# EAGLE design sddrive (EAGLE 9.6.2)
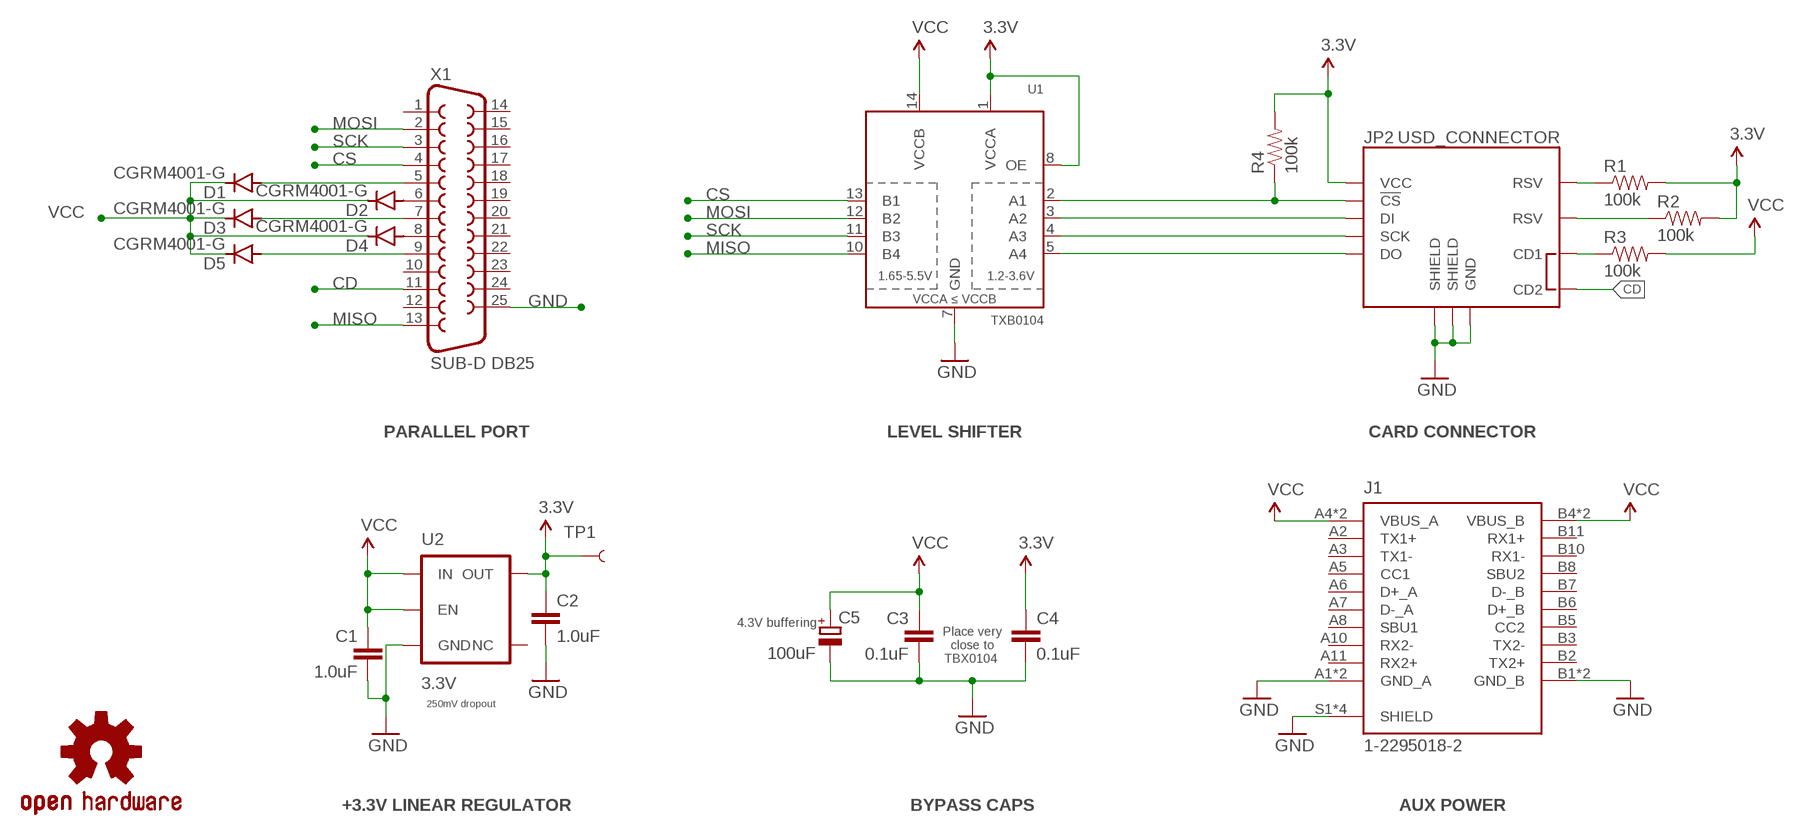
[diagram p0: schematic, sheet 1]

## Parts
C1  1.0uF  1.0UF-16V-10%(0603)  [0603-CAP]
C2  1.0uF  1.0UF-16V-10%(0603)  [0603-CAP]
C3  0.1uF  0.1UF-25V(+80/-20%)(0603)  [0603-CAP]
C4  0.1uF  0.1UF-25V(+80/-20%)(0603)  [0603-CAP]
C5  100uF  CPOL-EUC  [PANASONIC_C]
D1  CGRM4001-G  [SOD-123_MINI-SMA]
D2  CGRM4001-G  [SOD-123_MINI-SMA]
D3  CGRM4001-G  [SOD-123_MINI-SMA]
D4  CGRM4001-G  [SOD-123_MINI-SMA]
D5  CGRM4001-G  [SOD-123_MINI-SMA]
J1  1-2295018-2  [TE_1-2295018-2]
JP2  USD_CONNECTOR  [MICRO-SD-SOCKET-PP]
LOGO2  OSHW-LOGOS  [OSHW-LOGO-S]
R1  100k  100KOHM-1/10W-1%(0603)  [0603-RES]
R2  100k  100KOHM-1/10W-1%(0603)  [0603-RES]
R3  100k  100KOHM-1/10W-1%(0603)  [0603-RES]
R4  100k  100KOHM-1/10W-1%(0603)  [0603-RES]
TP1  TEST-POINT3  [PAD.03X.03]
U1  TXB0104  TXB0104PWRSOIC14  [SO14]
U2  3.3V  V_REG_AP2112K-3.3V  [SOT23-5]
X1  SUB-D DB25  F25D  [F25D]

## Nets
3V3: C2.1 C4.1 JP2.VCC R1.2 R2.2 R4.2 TP1.P$1 U1.1(VCCA) U1.8(OE) U2.5(OUT) ; supply symbol labelled 3.3V
!CS_3V3: JP2.CS(!CS) R4.1 U1.2(A1)
CD: JP2.CD2 X1.11
CDSDSD: JP2.CD1 R3.1
CS: U1.13(B1) X1.4
DI_3V3: JP2.DI U1.3(A2)
DO_3V3: JP2.DO U1.5(A4)
GND: C1.2 C2.2 C3.2 C4.2 C5.- J1.A1(GND_A) J1.A12(GND_A) J1.B1(GND_B) J1.B12(GND_B) J1.S1(SHIELD) J1.S2(SHIELD) J1.S3(SHIELD) J1.S4(SHIELD) JP2.GND JP2.GND1(SHIELD) JP2.GND3(SHIELD) U1.7(GND) U2.2(GND) X1.25
MISO: U1.10(B4) X1.13
MOSI: U1.12(B2) X1.2
N$1: D1.A X1.5
N$2: D2.A X1.6
N$3: D3.A X1.7
N$4: D4.A X1.8
N$5: D5.A X1.9
RSV@1: JP2.RSV1(RSV) R1.1
RSV@2: JP2.RSV2(RSV) R2.1
SCK: U1.11(B3) X1.3
SCK_3V3: JP2.SCLK(SCK) U1.4(A3)
VCC: C1.1 C3.1 C5.+ D1.C D2.C D3.C D4.C D5.C J1.A4(VBUS_A) J1.A9(VBUS_A) J1.B4(VBUS_B) J1.B9(VBUS_B) R3.2 U1.14(VCCB) U2.1(IN) U2.3(EN)
Unconnected: J1.A2(TX1+) J1.A3(TX1-) J1.A5(CC1) J1.A6(D+_A) J1.A7(D-_A) J1.A8(SBU1) J1.A10(RX2-) J1.A11(RX2+) J1.B2(TX2+) J1.B3(TX2-) J1.B5(CC2) J1.B6(D+_B) J1.B7(D-_B) J1.B8(SBU2) J1.B10(RX1-) J1.B11(RX1+) U2.4(NC) X1.1 X1.10 X1.12 X1.14 X1.15 X1.16 X1.17 X1.18 X1.19 X1.20 X1.21 X1.22 X1.23 X1.24

## Notes on the sheet
- PARALLEL PORT | LEVEL SHIFTER | CARD CONNECTOR
- 4.3V buffering
- Place very
  close to
  TBX0104
- 250mV dropout
- +3.3V LINEAR REGULATOR | BYPASS CAPS | AUX POWER

## Library data of the parts
C1 C2 = SparkFun-Capacitors:1.0UF-16V-10%(0603): CAP-00868; PROD_ID: CAP-00868
C3 C4 = SparkFun-Capacitors:0.1UF-25V(+80/-20%)(0603): CAP-00810 Ceramic Standard decoupling cap; PROD_ID: CAP-00810
C5 = rcl:CPOL-EU: POLARIZED CAPACITOR, European symbol; SPICEPREFIX: C
D1-D5 = diode:CGRM400*-G: Molded plasitc,JEDEC SOD-123/Mini SMA Source: Comchip CGRM4001-G.pdf
J1 = usb_c:1-2295018-2: Check availability <https://pricing.snapeda.com/parts/1-2295018-2/TE%20Connectivity%20AMP%20Connectors/view-part?ref=eda>; AVAILABILITY: In Stock; CHECK_PRICES: https://www.snapeda.com/parts/1-2295018-2/TE+Connectivity/view-part/?ref=eda; DESCRIPTION: USB TYPE C, REC OFFSET 0.65MM DUAL SMT;Tape/Reel of 900 | TE Connectivity 1-2295018-2; MF: TE Connectivity AMP Connectors; MP: 1-2295018-2; PACKAGE: None; PRICE: None; PURCHASE-URL: https://www.snapeda.com/api/url_track_click_mouser/?unipart_id=5630094&manufacturer=TE Connectivity AMP Connectors&part_name=1-2295018-2&search_term=None; SNAPEDA_LINK: https://www.snapeda.com/parts/1-2295018-2/TE+Connectivity/view-part/?ref=snap
JP2 = SparkFun-Connectors:USD_CONNECTOR: microSD Socket Push-push type µSD socket. Footprint production proven. Symbol has new and improved layout and naming accuracy. SparkFun Electronics SKU : PRT-00127. tDoc lines correctly indicate media card edge positions when inserting (unlocked, locked, depressed). NOTE: CD1 and CD2 are connected internally; PROD_ID: CONN-07820
LOGO2 = SparkFun-Aesthetics:OSHW-LOGO: Open Source Hardware Logo This logo indicates the piece of hardware it is found on incorporates a OSHW license and/or adheres to the definition of open source hardware found here: http://freedomdefined.org/OSHW
R1-R4 = SparkFun-Resistors:100KOHM-1/10W-1%(0603): RES-07828; PROD_ID: RES-07828
TP1 = SparkFun-Passives:TEST-POINT: Bare copper test points for troubleshooting or ICT
U1 = SparkFun-DigitalIC:TXB0104PWR: 4-Bit Bi-Directional Level Shifter 1.2V-3.6V (VCCA) to 1.65V-5.5V (VCCB) bi-directional level shifter with auto direction sensing. Max data rate - VCCA 1.8V: 20Mbps (50ns), VCCA 3.3V: 100Mbps (10ns) Digikey: 296-21929-1-ND (TSSOP) IC-11329; PROD_ID: IC-11329
U2 = SparkFun-PowerIC:V_REG_AP2112: AP2112 - 600mA CMOS LDO Regulator w/ Enable The AP2112 is CMOS process low dropout linear regulator with enable function, the regulator delivers a guaranteed 600mA (min.) continuous load current. Features Output Voltage Accuracy: ±1.5% Output Current: 600mA (Min.) Foldback Short Current Protection: 50mA Enable Function to Turn ON/OFF VOUT Low Dropout Voltage (3.3V): 250mV (Typ.) @IOUT=600mA Excellent Load Regulation: 0.2%/A (Typ.) Excellent Line Regulation: 0.02%/V (Typ.) Low Quiescent Current: 55μA (Typ.) Low Standby Current: 0.01μA (Typ.) Low Output Noise: 50μVRMS PSRR: 100Hz -65dB, 1kHz -65dB OTSD Protection Stable with 1.0μF Flexible Cap: Ceramic, Tantalum and Aluminum Electrolytic Operation Temperature Range: -40°C to 85°C ESD: MM 400V, HBM 4000V; PROD_ID: VREG-12457
X1 = con-subd:F25: SUB-D; OC_FARNELL: unknown; OC_NEWARK: unknown

## Board
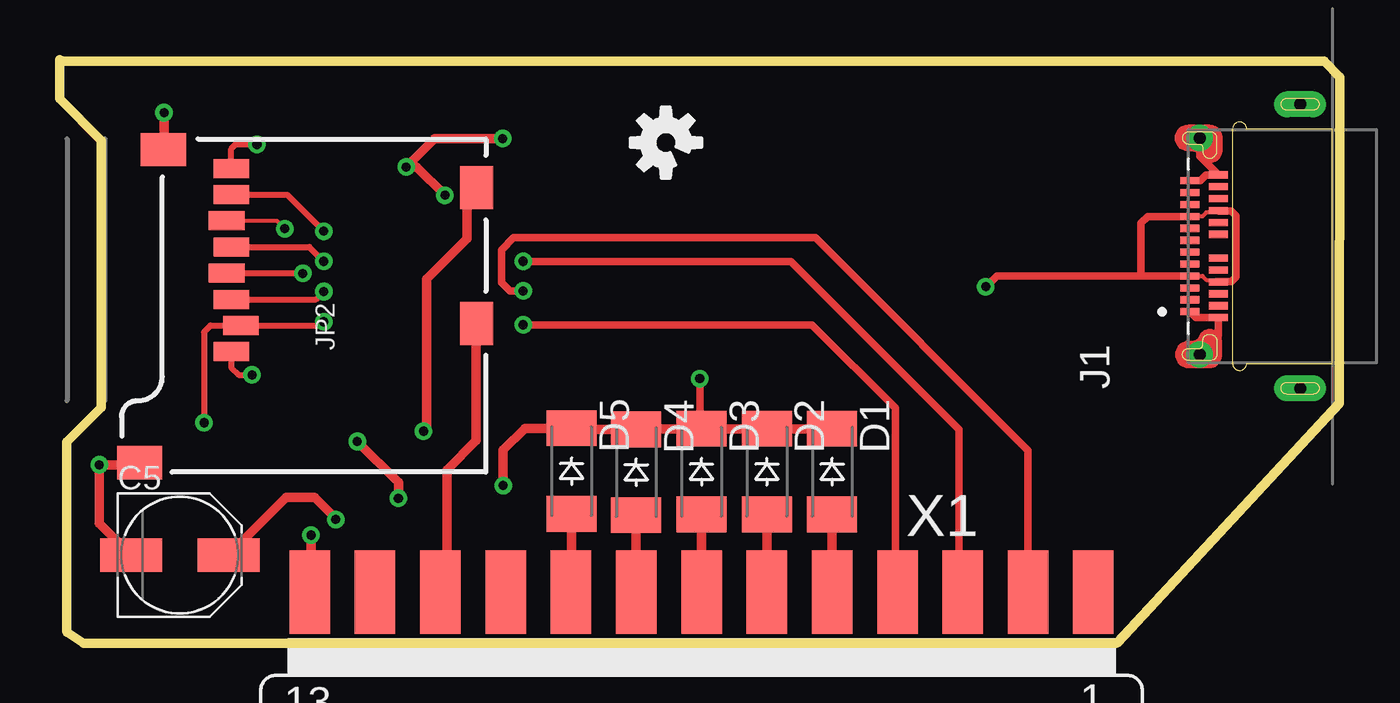
[diagram p1: board, top side]
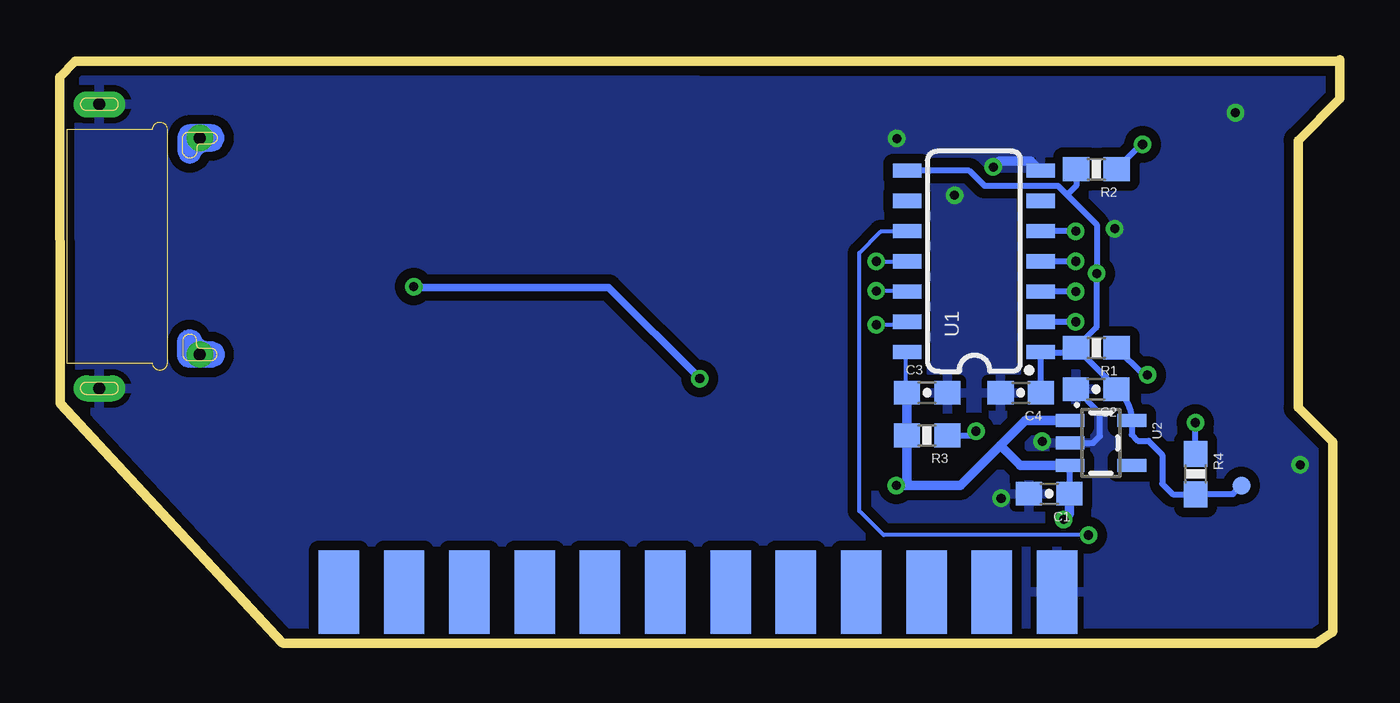
[diagram p2: board, bottom side, seen from below]

Size 53.8 x 24.54 mm. Coordinates in mm from the lower left corner, seen from the top.
Outline: 26.72,24.46 0.08,24.46 0,24.54 0,22.89 1.75,21.13 1.75,9.91 0.3,8.46 0.3,0.51
Outline: 26.82,24.46 53.14,24.46 53.8,23.8 53.77,10.08 44.45,0.03
Outline: 0.33,0.46 1.02,0 44.37,0
Copper layers (1*16): Top 0.035mm / dielectric 1.5mm / Bottom 0.035mm
Design rules "SparkFun-2-layer-TIGHT": minimum track width 7mil, minimum drill 15mil, track to track 7mil, track to pad 7mil, pad to pad 7mil, via to via 7mil, smd to smd 7mil, copper to edge 7mil, drill to drill 7mil, minimum pad ring 7mil, minimum via ring 7mil, stop-mask expansion 4mil, vias tented up to drill 20mil, thermal gap 10mil

### Footprints (pad centres in the part's own frame; a part is rotated, then mirrored left to right if it is on the bottom)
0603-CAP = smd 1.1 x 1: 1 -0.85,0; 2 0.85,0
PANASONIC_C = smd 2.6 x 1.4: + 2.05,0; - -2.05,0
SOD-123_MINI-SMA = smd 1.5 x 2.1: A 1.8,0; C -1.8,0
TE_1-2295018-2 = smd 0.3 x 0.8: A1 -2.75,4.63; A2 -2.25,4.63; A3 -1.75,4.63; A4 -1.25,4.63; A5 -0.75,4.63; A6 -0.25,4.63; A7 0.25,4.63; A8 0.75,4.63; A9 1.25,4.63; A10 1.75,4.63; A11 2.25,4.63; A12 2.75,4.63; B1 3,3.43; B2 2.5,3.43; B3 2,3.43; B4 1.5,3.43; B5 1,3.43; B6 0.5,3.43; B7 -0.5,3.43; B8 -1,3.43; B9 -1.5,3.43; B10 -2,3.43; B11 -2.5,3.43; B12 -3,3.43 | drill 0.5 pad 1.1 long: S1 -5.97,0; S2 5.97,0 | drill 0.5 pad 1.1: S3 -4.55,4.22; S4 4.55,4.22
MICRO-SD-SOCKET-PP = smd 1.8 x 1.4: CD1 -2.05,0.4; CD2 -7.75,0.4 | smd 0.8 x 1.5: CS -7.84,10.3; DI -6.74,10.7; DO -2.34,10.7; GND -3.44,10.9; RSV1 -8.94,10.7; RSV2 -1.24,10.7; SCLK -4.54,10.7; VCC -5.64,10.9 | smd 1.4 x 1.9: GND1 -13.6,14.55; GND3 -0.45,13.55
0603-RES = smd 1.1 x 1: 1 -0.85,0; 2 0.85,0
PAD.03X.03 = smd 0.762 x 0.762: P$1 0,0
SO14 = smd 0.6 x 1.2: 1 -3.81,-2.8; 2 -2.54,-2.8; 3 -1.27,-2.8; 4 0,-2.8; 5 1.27,-2.8; 6 2.54,-2.8; 7 3.81,-2.8; 8 3.81,2.8; 9 2.54,2.8; 10 1.27,2.8; 11 0,2.8; 12 -1.27,2.8; 13 -2.54,2.8; 14 -3.81,2.8
SOT23-5 = smd 0.55 x 1.2: 1 -0.95,-1.3; 2 0,-1.3; 3 0.95,-1.3; 4 0.95,1.3; 5 -0.95,1.3
F25D = smd 1.7 x 3.5: 1 -16.459,-6.045; 2 -13.716,-6.045; 3 -10.973,-6.045; 4 -8.23,-6.045; 5 -5.486,-6.045; 6 -2.743,-6.045; 7 0,-6.045; 8 2.743,-6.045; 9 5.486,-6.045; 10 8.23,-6.045; 11 10.973,-6.045; 12 13.716,-6.045; 13 16.459,-6.045 | smd 1.7 x 3.5 bottom: 14 -15.088,-6.045; 15 -12.344,-6.045; 16 -9.601,-6.045; 17 -6.858,-6.045; 18 -4.115,-6.045; 19 -1.372,-6.045; 20 1.372,-6.045; 21 4.115,-6.045; 22 6.858,-6.045; 23 9.601,-6.045; 24 12.344,-6.045; 25 15.088,-6.045

### Placement (x,y rotation side)
C1  12.22,6.29 180 bottom
C2  10.25,10.68 180 bottom
C3  17.35,10.53 0 bottom
C4  13.41,10.53 180 bottom
C5  5.05,3.71 0 top
D1  32.46,7.21 270 top
D2  29.72,7.21 270 top
D3  26.97,7.21 270 top
D4  24.23,7.19 270 top
D5  21.51,7.24 270 top
J1  52.12,16.69 90 top
JP2  17.92,21.2 90 top
LOGO2  25.48,21.04 45 top
R1  10.24,12.42 180 bottom
R2  10.24,19.93 180 bottom
R3  17.35,8.74 180 bottom
R4  6.07,7.11 270 bottom
TP1  4.14,6.63 270 bottom
U1  15.38,16.05 90 bottom
U2  10.05,8.42 270 bottom
X1  26.97,-3.89 180 top

### Tracks (layer width: path | path; a pad name or v marks a point on that pad's centre or on a via)
3V3  (via drill 0.38)
  Top 0.254: v10.22,15.54 7.03,15.54 JP2.VCC
  Bottom 0.254: 11.5,18.88 10.22,17.6 v10.22,15.54 10.24,15.53 10.24,13.27 R1.2 | 11.5,18.88 11.85,19.23 14.93,19.23 15.57,19.86 U1.8 | R1.2 11.29,12.22 12.55,12.22 U1.1 12.56,12.22 C4.1 | R2.2 11.09,19.23 11.43,18.88 11.5,18.88 | R1.2 9.4,10.73 C2.1 arc53 U2.5 8.75,8.77 8.48,8.51 8.05,8.51 7.47,7.92 7.47,6.71 7.02,6.26 R4.2 6.07,6.27 4.5,6.27 TP1.P$1
!CS_3V3  (via drill 0.38)
  Top 0.254: v11.1,13.51 11.1,13.36 JP2.CS 6.35,13.36 6.07,13.08 v6.07,9.27
  Bottom 0.254: v11.1,13.51 U1.2 | R4.1 v6.07,9.27
CD
  Top 0.178: 17.5,12.93 17.5,13.44 17.51,13.45 JP2.CD2
  Top 0.406: X1.11 16.28,2.44 16.28,7.3 17.5,8.52 17.5,12.93
CDSDSD  (via drill 0.38)
  Top 0.254: 17.12,18.75 JP2.CD1
  Top 0.406: v15.29,8.92 15.42,9.04 15.42,15.32 17.12,17.02 17.12,18.75
  Bottom 0.254: R3.1 15.47,8.74 v15.29,8.92
CS  (via drill 0.38)
  Top 0.305: v19.48,13.39 31.62,13.39 35.13,9.88 35.13,2.18
  Top 0.406: X1.4 35.18,2.18 35.13,2.18
  Bottom 0.178: v19.48,13.39 18.24,13.39 18.24,13.45 U1.13
DI_3V3  (via drill 0.38)
  Top 0.254: JP2.DI 10.77,14.46 v11.1,14.78
  Bottom 0.254: v11.1,14.78 U1.3
DO_3V3  (via drill 0.38)
  Top 0.254: JP2.DO 9.57,18.86 v11.1,17.32
  Bottom 0.254: v11.1,17.32 U1.5
GND  (via drill 0.38)
  Top 0.178: JP2.GND 9.13,17.76 v9.46,17.42
  Top 0.305: J1.A12 47.92,19.44 48.15,19.67 48.67,19.67 J1.B1 47.9,20.48 J1.S4 | J1.A1 47.74,13.69 J1.B12 48.69,12.93 J1.S3
  Top 0.406: JP2.GND1 3.28,7.51 v1.68,7.51 1.68,5.04 C5.- | v4.39,22.3 4.39,20.77 JP2.GND3 | v18.62,21.21 15.76,21.21 v14.57,20.01 15.01,20.01 v16.19,18.83 | v12.51,8.48 14.24,6.76 v14.24,6.1
  Bottom 0.254: U2.2 10.38,8.42 10.08,8.71 10.08,9.67 C2.2
  Bottom 0.406: U1.7 12.99,20.27 14.31,20.27 v14.57,20.01
  pour Bottom (isolate 0.406): 44.17,0.33 0.41,0.33 0.36,0.28 0.36,8.41 1.83,9.88 1.83,21.21 0.23,22.81 0.23,24.49 53.7,24.49 53.7,9.86
MISO  (via drill 0.38)
  Top 0.178: v10.57,4.55 10.59,4.52
  Top 0.406: 10.59,2.23 X1.13 10.57,2.21 v10.57,4.55
  Bottom 0.178: v10.57,4.55 19.18,4.55 20.19,5.56 20.19,16.41 19.3,17.3 18.24,17.3 18.21,17.32 U1.10
MOSI  (via drill 0.38)
  Top 0.305: v19.48,14.81 18.92,14.81 18.57,15.16 18.57,16.54 19.07,17.04 31.75,17.04 40.69,8.1 X1.2
  Top 0.406: X1.2 40.64,2.21
  Bottom 0.178: U1.12 18.2,14.81 v19.48,14.81
N$1
  Top 0.406: D1.A X1.5 | X1.5
N$2
  Top 0.406: D2.A X1.6 | X1.6
N$3
  Top 0.406: D3.A X1.7
N$4
  Top 0.406: D4.A X1.8
N$5
  Top 0.406: D5.A 21.51,2.18 X1.9
RSV@1  (via drill 0.38)
  Top 0.254: JP2.RSV1 7.22,11.58 7.52,11.28 v8.09,11.28
  Bottom 0.254: R1.1 8.24,11.28 v8.09,11.28
RSV@2  (via drill 0.38)
  Top 0.254: JP2.RSV2 7.22,20.78 7.4,20.97 v8.29,20.97
  Bottom 0.254: R2.1 8.34,20.97 v8.29,20.97
SCK  (via drill 0.38)
  Top 0.305: v19.48,16.05 30.73,16.05 37.8,8.99 37.8,2.18
  Top 0.406: X1.3 37.92,2.18 37.8,2.18
  Bottom 0.178: v19.48,16.05 U1.11
SCK_3V3  (via drill 0.38)
  Top 0.254: JP2.SCLK 10.5,16.66 v11.1,16.05
  Bottom 0.254: v11.1,16.05 U1.4
VCC  (via drill 0.38)
  Top 0.178: 26.9,9.09 D3.C | J1.B4 48.61,18.1 48.18,18.1 48.01,17.94 J1.A9 | J1.B9 48.61,15.27 48.18,15.27 48.01,15.44 J1.A4
  Top 0.305: v26.9,11.12 26.9,9.09 | J1.A4 45.44,15.44 | 45.44,15.44 39.37,15.44 v38.92,14.98 | J1.A9 45.73,17.94 45.44,17.65 45.44,15.44 | J1.B4 48.71,18.17 49.23,18.17 49.42,17.97 49.42,15.4 49.23,15.21 48.71,15.21 J1.B9
  Top 0.406: D1.C D2.C D3.C 24.26,9.01 D4.C 21.56,8.99 D5.C 19.55,9.04 18.64,8.13 v18.64,6.63 | C5.+ 9.53,6.13 10.72,6.13 11.61,5.25 v11.61,5.21 | v38.92,14.98 v38.91,14.99
  Bottom 0.178: 18.24,12.14 18.24,10.54 18.21,10.54 C3.1 | U2.1 11.37,9.4 11.56,9.4
  Bottom 0.254: C1.1 11.37,7.45 U2.3 | 18.2,12.22 U1.14 | 18.2,6.74 18.08,6.63
  Bottom 0.305: v38.91,14.99 38.89,14.96 30.73,14.96 v26.9,11.12
  Bottom 0.406: 14.27,8.31 15.95,6.63 18.08,6.63 v18.64,6.63 | 18.2,6.74 R3.2 C3.1 | 11.56,9.4 11.58,9.37 13.21,9.37 14.27,8.31 | 14.27,8.31 13.44,7.47 U2.3 | 18.24,12.14 18.24,12.19 18.2,12.22 | C1.1 11.37,5.45 v11.61,5.21

### Text on the board
tDocu: SDPP v.1.1. | github.com/nilseuropa/sdpp | !!! WARNING !!! / Populate barrier diodes / only if your port is / IEEE1284 compliant.